# Altium schematic sheet Top_Level.SchDoc
size A4; SheetNumber: 1; SheetTotal: 9
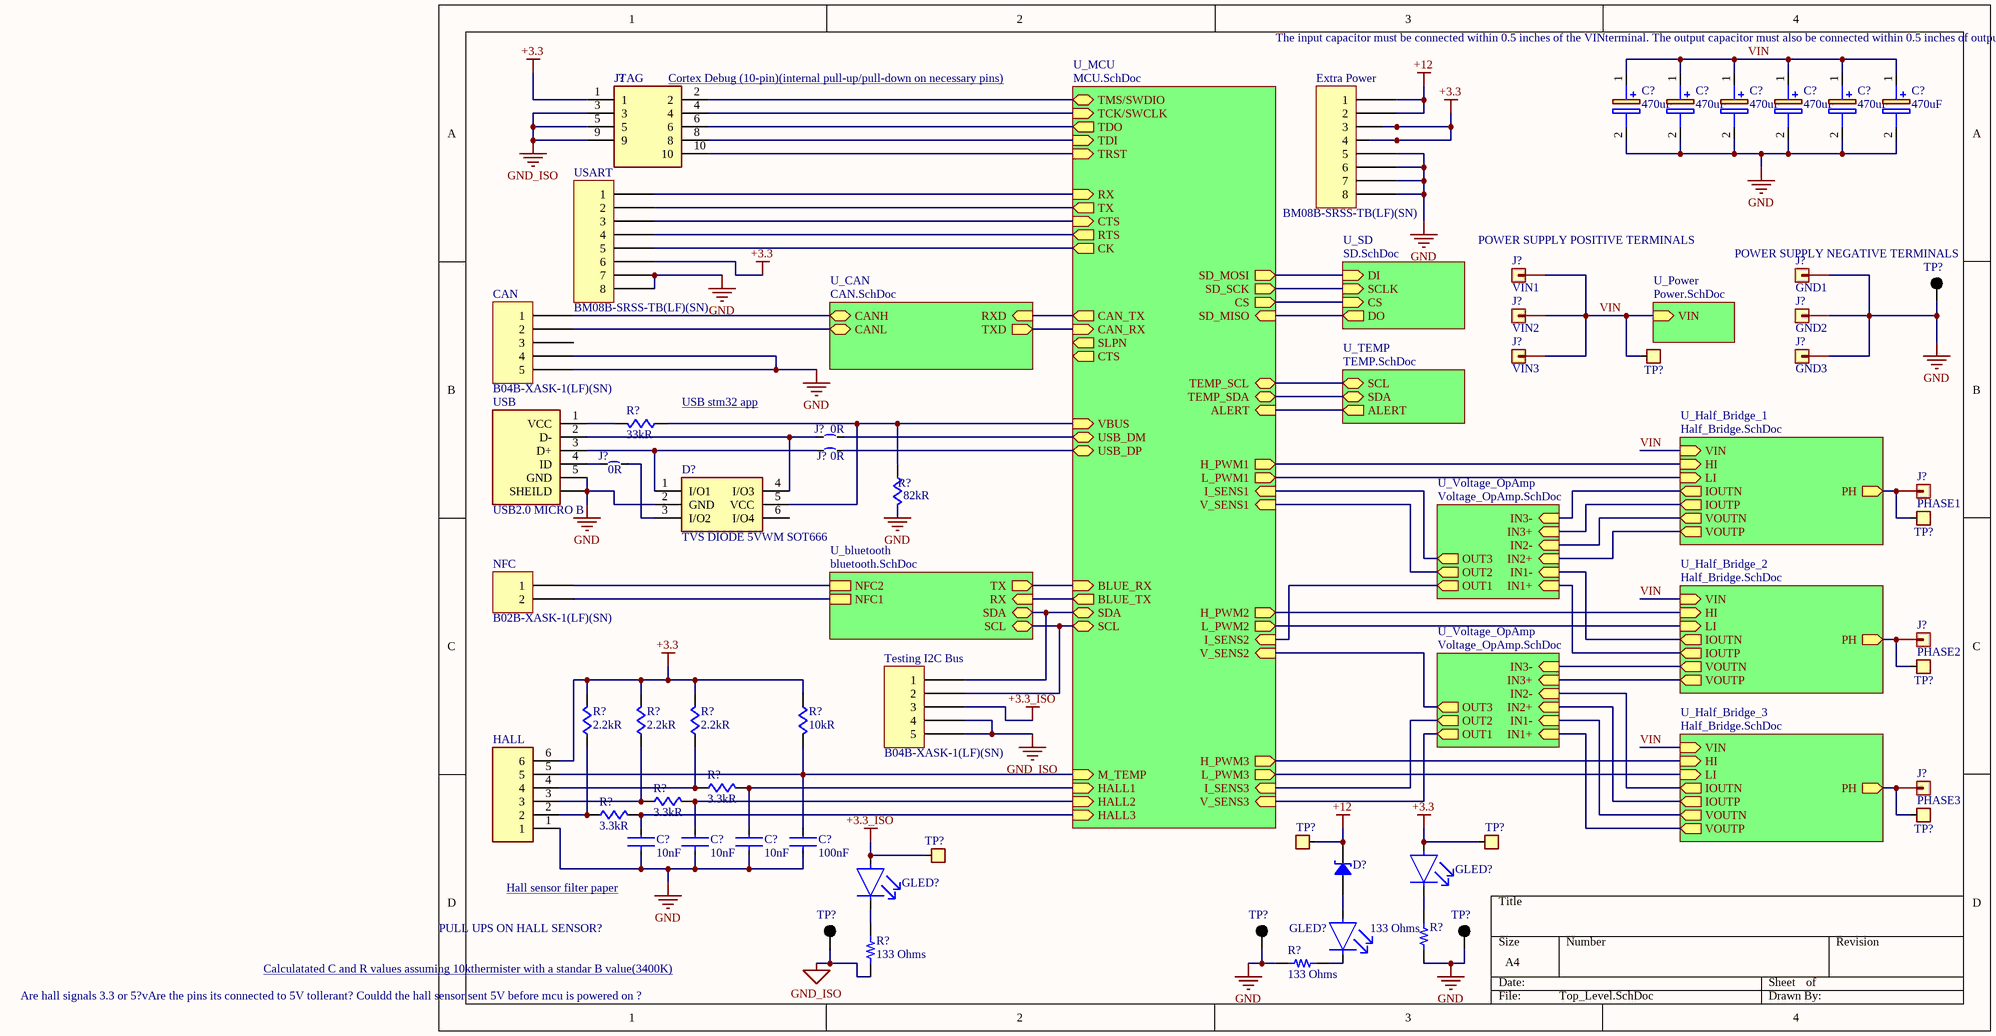
[diagram p0: Top_Level.SchDoc]

## Parts
(Parts that share a designator on the sheet are numbered #1, #2 ... from top to bottom, then left to right.)
C?#1  value 470uF  [EEEFK0J103SM]  (hidden comment: CAP ALUM 470UF 20% 80V SMD)
C?#2  value 470uF  [EEEFK0J103SM]  (hidden comment: CAP ALUM 470UF 20% 80V SMD)
C?#3  value 470uF  [EEEFK0J103SM]  (hidden comment: CAP ALUM 470UF 20% 80V SMD)
C?#4  value 470uF  [EEEFK0J103SM]  (hidden comment: CAP ALUM 470UF 20% 80V SMD)
C?#5  value 470uF  [EEEFK0J103SM]  (hidden comment: CAP ALUM 470UF 20% 80V SMD)
C?#6  value 470uF  [EEEFK0J103SM]  (hidden comment: CAP ALUM 470UF 20% 80V SMD)
C?#7  value 10nF  [FP-CGA3E-0_3-0_1-IPC_C]  (hidden comment: CER 10000PF 100V X7R 0603)
C?#8  value 10nF  [FP-CGA3E-0_3-0_1-IPC_C]  (hidden comment: CER 10000PF 100V X7R 0603)
C?#9  value 10nF  [FP-CGA3E-0_3-0_1-IPC_C]  (hidden comment: CER 10000PF 100V X7R 0603)
C?#10  value 100nF  [FP-CGA3E-0_3-0_1-IPC_C]  (hidden comment: CER 0.1UF 100V X7R 0603)
CAN  B04B-XASK-1(LF)(SN)  [JST B04B-XASK-1]
D?#1  TVS DIODE 5VWM SOT666  [SOTFL50P160X60-6N]
D?#2  MMSZ5238BT1G  [SOD-123]  (value not drawn)
Extra_Power  BM08B-SRSS-TB(LF)(SN)  [JST BM08B-SRSS-TB]
GLED?#1  LED GREEN CLEAR SMD  [FP-LTST-C191KGKT-MFG]  (value not drawn)
GLED?#2  LED GREEN CLEAR SMD  [FP-LTST-C191KGKT-MFG]  (value not drawn)
GLED?#3  LED GREEN CLEAR SMD  [FP-LTST-C191KGKT-MFG]  (value not drawn)
HALL  CONN HEADER VERT 6POS 2MM  [JST B6B-PH-K]  (value not drawn)
J?#1  JTAG  [FTSH10501LDV007K]
J?#2  VIN1  [J100A]
J?#3  GND1  [J100A]
J?#4  VIN2  [J100A]
J?#5  GND2  [J100A]
J?#6  VIN3  [J100A]
J?#7  GND3  [J100A]
J?#8  value 0R  [FP-RK73Z1J-IPC_C]  (hidden comment: RES 0 OHM JUMPER 0603)
J?#9  value 0R  [FP-RK73Z1J-IPC_C]  (hidden comment: RES 0 OHM JUMPER 0603)
J?#10  value 0R  [FP-RK73Z1J-IPC_C]  (hidden comment: RES 0 OHM JUMPER 0603)
J?#11  PHASE1  [J100A]
J?#12  PHASE2  [J100A]
J?#13  PHASE3  [J100A]
NFC  B02B-XASK-1(LF)(SN)  [JST B02B-XASK-1]
R?#1  value 33kR  [FP-RMCF0603-IPC_C]  (hidden comment: x)
R?#2  value 82kR  [FP-RMCF0603-IPC_C]  (hidden comment: x)
R?#3  value 2.2kR  [FP-RMCF0603-IPC_C]  (hidden comment: x)
R?#4  value 2.2kR  [FP-RMCF0603-IPC_C]  (hidden comment: x)
R?#5  value 2.2kR  [FP-RMCF0603-IPC_C]  (hidden comment: x)
R?#6  value 10kR  [FP-RMCF0603-IPC_C]  (hidden comment: RES 10K OHM 1% 1/10W 0603)
R?#7  value 3.3kR  [FP-RMCF0603-IPC_C]  (hidden comment: x)
R?#8  value 3.3kR  [FP-RMCF0603-IPC_C]  (hidden comment: x)
R?#9  value 3.3kR  [FP-RMCF0603-IPC_C]  (hidden comment: x)
R?#10  133 Ohms  [RES 0603_1608]
R?#11  133 Ohms  [RES 0603_1608]
R?#12  133 Ohms  [RES 0603_1608]
Testing_I2C_Bus  B04B-XASK-1(LF)(SN)  [JST B04B-XASK-1]
TP?#1  PC TEST POINT MULTIPURPOSE BLACK  [KSTN-5011_V]  (value not drawn)
TP?#2  PC TEST POINT MINIATURE WHITE  [FP-5002-MFG]  (value not drawn)
TP?#3  PC TEST POINT MINIATURE WHITE  [FP-5002-MFG]  (value not drawn)
TP?#4  PC TEST POINT MINIATURE WHITE  [FP-5002-MFG]  (value not drawn)
TP?#5  PC TEST POINT MINIATURE WHITE  [FP-5002-MFG]  (value not drawn)
TP?#6  PC TEST POINT MINIATURE WHITE  [FP-5002-MFG]  (value not drawn)
TP?#7  PC TEST POINT MINIATURE WHITE  [FP-5002-MFG]  (value not drawn)
TP?#8  PC TEST POINT MINIATURE WHITE  [FP-5002-MFG]  (value not drawn)
TP?#9  PC TEST POINT MULTIPURPOSE BLACK  [KSTN-5011_V]  (value not drawn)
TP?#10  PC TEST POINT MULTIPURPOSE BLACK  [KSTN-5011_V]  (value not drawn)
TP?#11  PC TEST POINT MULTIPURPOSE BLACK  [KSTN-5011_V]  (value not drawn)
USART  BM08B-SRSS-TB(LF)(SN)  [JST BM08B-SRSS-TB]
USB  USB2.0 MICRO B  [101181930001LF]

## Sub-sheets
U_bluetooth = bluetooth.SchDoc: NFC2, NFC1, TX (out), RX (in), SDA (bidir), SCL (bidir)
U_CAN = CAN.SchDoc: CANH (bidir), CANL (bidir), TXD (out), RXD (in)
U_Half_Bridge_1 = Half_Bridge.SchDoc: VIN (in), HI (in), LI (in), PH (out), VOUTP (out), VOUTN (out), IOUTP (out), IOUTN (out)
U_Half_Bridge_2 = Half_Bridge.SchDoc: VIN (in), HI (in), LI (in), PH (out), VOUTN (out), VOUTP (out), IOUTP (out), IOUTN (out)
U_Half_Bridge_3 = Half_Bridge.SchDoc: VIN (in), HI (in), LI (in), PH (out), VOUTP (out), VOUTN (out), IOUTP (out), IOUTN (out)
U_MCU = MCU.SchDoc: I_SENS1 (in), I_SENS2 (in), I_SENS3 (in), V_SENS1 (in), V_SENS3 (in), V_SENS2 (in), L_PWM1 (out), L_PWM2 (out), H_PWM1 (out), H_PWM2 (out), H_PWM3 (out), TX (out), RX (in), HALL1 (in), HALL2 (in), HALL3 (in), M_TEMP (in), TRST (in), TDO (out), TMS/SWDIO (bidir), TCK/SWCLK (in), TDI (in), VBUS (in), USB_DM (bidir), USB_DP (bidir), L_PWM3 (out), TEMP_SCL (bidir), TEMP_SDA (bidir), CAN_RX (in), CAN_TX (out), CTS (out), SLPN (out), ALERT (in), CTS (in), RTS (out), CK (out), SD_SCK (out), SD_MISO (in), SD_MOSI (out), CS (out), BLUE_RX (in), BLUE_TX (out), SDA (bidir), SCL (bidir)
U_Power = Power.SchDoc: VIN (in)
U_SD = SD.SchDoc: DI (in), SCLK (in), DO (out), CS (in)
U_TEMP = TEMP.SchDoc: SCL (bidir), SDA (bidir), ALERT (out)
U_Voltage_OpAmp = Voltage_OpAmp.SchDoc: IN1- (in), IN1+ (in), OUT1 (out), IN2+ (in), IN2- (in), OUT2 (out), IN3+ (in), IN3- (in), OUT3 (out)
U_Voltage_OpAmp = Voltage_OpAmp.SchDoc: IN1- (in), IN1+ (in), OUT1 (out), IN2+ (in), IN2- (in), OUT2 (out), IN3+ (in), IN3- (in), OUT3 (out)

## Nets
+3.3: Extra_Power.3 Extra_Power.4 GLED?#1.2(A) HALL.6 J?#1.1 R?#3.2 R?#4.2 R?#5.2 R?#6.1 TP?#7.1 USART.6
+3.3_ISO: GLED?#2.2(A) Testing_I2C_Bus.3 TP?#8.1
+12: D?#2.2 Extra_Power.1 Extra_Power.2 TP?#6.1
GND: C?#1.2(-) C?#2.2(-) C?#3.2(-) C?#4.2(-) C?#5.2(-) C?#6.2(-) C?#7.1 C?#8.1 C?#9.1 C?#10.1 CAN.4 CAN.5 D?#1.2(GND) Extra_Power.5 Extra_Power.6 Extra_Power.7 Extra_Power.8 HALL.1 J?#3.1(Pin_1) J?#5.1(Pin_1) J?#7.1(Pin_1) R?#2.2 R?#10.1 R?#12.1 TP?#1.1 TP?#10.1 TP?#11.1 USART.7 USART.8 USB.5(GND) USB.MH1(SHEILD) USB.MH2 USB.MP1 USB.MP2 USB.MP3 USB.MP4
GND_ISO: J?#1.3 J?#1.5 J?#1.9 R?#11.1 Testing_I2C_Bus.4 Testing_I2C_Bus.5 TP?#9.1
VIN: C?#1.1(+) C?#2.1(+) C?#3.1(+) C?#4.1(+) C?#5.1(+) C?#6.1(+) J?#2.1(Pin_1) J?#4.1(Pin_1) J?#6.1(Pin_1) TP?#2.1 ; sheet U_Half_Bridge_1/VIN, sheet U_Power/VIN, sheet U_Half_Bridge_2/VIN, sheet U_Half_Bridge_3/VIN
NetC?#7_2: C?#7.2 R?#9.2 ; sheet U_MCU/HALL3
NetC?#8_2: C?#8.2 R?#8.2 ; sheet U_MCU/HALL2
NetC?#9_2: C?#9.2 R?#7.2 ; sheet U_MCU/HALL1
NetC?#10_2: C?#10.2 HALL.5 R?#6.2 ; sheet U_MCU/M_TEMP
NetCAN_1: CAN.1 ; sheet U_CAN/CANH
NetCAN_2: CAN.2 ; sheet U_CAN/CANL
NetD?#1_1: D?#1.1(I/O1) J?#9.1 USB.3(D+)
NetD?#1_3: D?#1.3(I/O2) J?#10.2
NetD?#1_4: D?#1.4(I/O3) J?#8.1 USB.2(D-)
NetD?#1_5: D?#1.5(VCC) R?#1.1 R?#2.1 ; sheet U_MCU/VBUS
NetD?#2_1: D?#2.1 GLED?#3.2(A)
NetGLED?#1_1: GLED?#1.1(C) R?#10.2
NetGLED?#2_1: GLED?#2.1(C) R?#11.2
NetGLED?#3_1: GLED?#3.1(C) R?#12.2
NetHALL_2: HALL.2 R?#3.1 R?#9.1
NetHALL_3: HALL.3 R?#4.1 R?#8.1
NetHALL_4: HALL.4 R?#5.1 R?#7.1
NetJ?#1_2: J?#1.2 ; sheet U_MCU/TMS/SWDIO
NetJ?#1_4: J?#1.4 ; sheet U_MCU/TCK/SWCLK
NetJ?#1_6: J?#1.6 ; sheet U_MCU/TDO
NetJ?#1_8: J?#1.8 ; sheet U_MCU/TDI
NetJ?#1_10: J?#1.10 ; sheet U_MCU/TRST
NetJ?#8_2: J?#8.2 ; sheet U_MCU/USB_DM
NetJ?#9_2: J?#9.2 ; sheet U_MCU/USB_DP
NetJ?#10_1: J?#10.1 USB.4(ID)
NetJ?#11_1: J?#11.1(Pin_1) TP?#3.1 ; sheet U_Half_Bridge_1/PH
NetJ?#12_1: J?#12.1(Pin_1) TP?#4.1 ; sheet U_Half_Bridge_2/PH
NetJ?#13_1: J?#13.1(Pin_1) TP?#5.1 ; sheet U_Half_Bridge_3/PH
NetNFC_1: NFC.1 ; sheet U_bluetooth/NFC2
NetNFC_2: NFC.2 ; sheet U_bluetooth/NFC1
NetR?#1_2: R?#1.2 USB.1(VCC)
NetTesting_I2C_Bus_1: Testing_I2C_Bus.1 ; sheet U_MCU/SDA, sheet U_bluetooth/SDA
NetTesting_I2C_Bus_2: Testing_I2C_Bus.2 ; sheet U_MCU/SCL, sheet U_bluetooth/SCL
NetUSART_1: USART.1 ; sheet U_MCU/RX
NetUSART_2: USART.2 ; sheet U_MCU/TX
NetUSART_3: USART.3 ; sheet U_MCU/CTS
NetUSART_4: USART.4 ; sheet U_MCU/RTS
NetUSART_5: USART.5 ; sheet U_MCU/CK
(unnamed): sheet U_Half_Bridge_1/HI, sheet U_MCU/H_PWM1
(unnamed): sheet U_Half_Bridge_1/LI, sheet U_MCU/L_PWM1
(unnamed): sheet U_Half_Bridge_1/VOUTP, sheet U_Voltage_OpAmp/IN2+
(unnamed): sheet U_Half_Bridge_1/VOUTN, sheet U_Voltage_OpAmp/IN2-
(unnamed): sheet U_Half_Bridge_1/IOUTP, sheet U_Voltage_OpAmp/IN3+
(unnamed): sheet U_Half_Bridge_1/IOUTN, sheet U_Voltage_OpAmp/IN3-
(unnamed): sheet U_MCU/I_SENS1, sheet U_Voltage_OpAmp/OUT3
(unnamed): sheet U_MCU/I_SENS2, sheet U_Voltage_OpAmp/OUT1
(unnamed): sheet U_MCU/I_SENS3, sheet U_Voltage_OpAmp/OUT2
(unnamed): sheet U_MCU/V_SENS1, sheet U_Voltage_OpAmp/OUT2
(unnamed): sheet U_MCU/V_SENS3, sheet U_Voltage_OpAmp/OUT1
(unnamed): sheet U_MCU/V_SENS2, sheet U_Voltage_OpAmp/OUT3
(unnamed): sheet U_MCU/L_PWM2, sheet U_Half_Bridge_2/LI
(unnamed): sheet U_MCU/H_PWM2, sheet U_Half_Bridge_2/HI
(unnamed): sheet U_MCU/H_PWM3, sheet U_Half_Bridge_3/HI
(unnamed): sheet U_MCU/L_PWM3, sheet U_Half_Bridge_3/LI
(unnamed): sheet U_MCU/TEMP_SCL, sheet U_TEMP/SCL
(unnamed): sheet U_MCU/TEMP_SDA, sheet U_TEMP/SDA
(unnamed): sheet U_MCU/CAN_RX, sheet U_CAN/TXD
(unnamed): sheet U_MCU/CAN_TX, sheet U_CAN/RXD
(unnamed): sheet U_MCU/ALERT, sheet U_TEMP/ALERT
(unnamed): sheet U_MCU/SD_SCK, sheet U_SD/SCLK
(unnamed): sheet U_MCU/SD_MISO, sheet U_SD/DO
(unnamed): sheet U_MCU/SD_MOSI, sheet U_SD/DI
(unnamed): sheet U_MCU/CS, sheet U_SD/CS
(unnamed): sheet U_MCU/BLUE_RX, sheet U_bluetooth/TX
(unnamed): sheet U_MCU/BLUE_TX, sheet U_bluetooth/RX
(unnamed): sheet U_Half_Bridge_2/VOUTN, sheet U_Voltage_OpAmp/IN3-
(unnamed): sheet U_Half_Bridge_2/VOUTP, sheet U_Voltage_OpAmp/IN3+
(unnamed): sheet U_Half_Bridge_2/IOUTP, sheet U_Voltage_OpAmp/IN1+
(unnamed): sheet U_Half_Bridge_2/IOUTN, sheet U_Voltage_OpAmp/IN1-
(unnamed): sheet U_Half_Bridge_3/VOUTP, sheet U_Voltage_OpAmp/IN1+
(unnamed): sheet U_Half_Bridge_3/VOUTN, sheet U_Voltage_OpAmp/IN1-
(unnamed): sheet U_Half_Bridge_3/IOUTP, sheet U_Voltage_OpAmp/IN2+
(unnamed): sheet U_Half_Bridge_3/IOUTN, sheet U_Voltage_OpAmp/IN2-

Not connected (* = marked no-connect by the designer): CAN 3; D?#1 6(I/O4)

## Notes on the sheet
- (near C?#1) The input capacitor must be connected within 0.5 inches of the VINterminal. The output capacitor must also be connected within 0.5 inches of output pinText
- (near J?#1) Cortex Debug (10-pin)(internal pull-up/pull-down on necessary pins) <https://developer.arm.com/documentation/101416/0100/Hardware-Description/Target-Interfaces/Cortex-Debug--10-pin->
- (near J?#2) POWER SUPPLY POSITIVE TERMINALS
- (near J?#3) POWER SUPPLY NEGATIVE TERMINALS
- (near R?#1) USB stm32 app <https://www.st.com/resource/en/application_note/an4879-introduction-to-usb-hardware-and-pcb-guidelines-using-stm32-mcus-stmicroelectronics.pdf>
- Hall sensor filter paper <https://ieeexplore.ieee.org/document/7045256?denied=>
- Calculatated C and R values assuming 10kthermister with a standar B value(3400K) <https://www.ti.com/lit/an/sbaa338a/sbaa338a.pdf?ts=1684666864738&ref_url=https%253A%252F%252Fwww.google.com%252F>
- PULL UPS ON HALL SENSOR?
- Are hall signals 3.3 or 5?vAre the pins its connected to 5V tollerant? Couldd the hall sensor sent 5V before mcu is powered on ?

## Library data of the parts
C?#1-C?#6 = EEV-FK1K471M: Manufacturer: Panasonic; Dielectric Material: Aluminium; Polarity: Polarized; Leakage Current: 376uA; Ripple Current: 687.75mA; Tan Delta: 0.08; Reference Standard: AEC-Q200; Supplier: Digi-Key; Supplier Part Number: PCE3496CT-ND; Manufacturer Part Number: EEV-FK1K471M; RoHS: Yes; Category: Aluminum Electrolytic Capacitors; Stock: 7035; Pricing: 1=2.41, 10=1.947, 50=1.6988 (USD); Mounting Technology: Surface Mount; Pins: 2; Case/Package: 7575; Min Operating Temperature: -55°C; Max Operating Temperature: 105°C; Capacitor Type: Aluminium; Tolerance  (fill in as +-): 20%; Package Style: SMTMeter; Packaging: Tape and Reel; Tolerance (fill in as +-): 20%; Rated DC Voltage (URdc): 80V; Termination: Flat; Length: 21mm; Width: 19mm; Height: 16.5mm; Reach SVHC Compliant: Yes; RoHS Compliant: Yes; ComponentLink1URL: https://datasheet.ciiva.com:443/pdfs/VipMasterIC/IC/PANA/PANA-S-A0009782343/PANA-S-A0009782343-1.pdf?src-supplier=IHS+Markit; ComponentLink1Description: https://datasheet.ciiva.com:443/pdfs/VipMasterIC/IC/PANA/PANA-S-A0009782343/PANA-S-A0009782343-1.pdf?src-supplier=IHS+Markit; ComponentLink2URL: https://datasheet.ciiva.com/14606/70258115-14606333.pdf?src-supplier=Allied+Electronics; ComponentLink2Description: https://datasheet.ciiva.com/14606/70258115-14606333.pdf?src-supplier=Allied+Electronics; ComponentLink3URL: https://datasheet.ciiva.com/43485/1676921-43485532.pdf?src-supplier=Farnell; ComponentLink3Description: https://datasheet.ciiva.com/43485/1676921-43485532.pdf?src-supplier=Farnell; ComponentLink4URL: https://datasheet.ciiva.com/2984/aba0000ce120-2984088.pdf?src-supplier=Avnet; ComponentLink4Description: https://datasheet.ciiva.com/2984/aba0000ce120-2984088.pdf?src-supplier=Avnet; ComponentLink5URL: https://datasheet.ciiva.com/30158/eev-fkseries-30158795.pdf?src-supplier=Onlinecomponents.com; ComponentLink5Description: https://datasheet.ciiva.com/30158/eev-fkseries-30158795.pdf?src-supplier=Onlinecomponents.com; ComponentLink6URL: https://datasheet.ciiva.com/14603/70258115-14603897.pdf?src-supplier=Allied+Electronics; ComponentLink6Description: https://datasheet.ciiva.com/14603/70258115-14603897.pdf?src-supplier=Allied+Electronics; ComponentLink7URL: https://datasheet.ciiva.com/48483/aba0000ce120-48483340.pdf?src-supplier=Avnet; ComponentLink7Description: https://datasheet.ciiva.com/48483/aba0000ce120-48483340.pdf?src-supplier=Avnet
C?#7-C?#9 = GCM188R72A103KA37D: Manufacturer: Murata; Dielectric Material: Ceramic; Multilayer: Yes; Tolerance  (fill in as +-): 10%; Reference Standard: AEC-Q200; Supplier: Digi-Key; Supplier Part Number: 490-4781-1-ND; Manufacturer Part Number: GCM188R72A103KA37D; RoHS: Yes; Category: Ceramic Capacitors; Stock: 8991008; Pricing: 1=0.1, 10=0.057, 50=0.031, 100=0.0252, 500=0.01802, 1000=0.01417 (USD); Mounting Technology: Surface Mount; Pins: 2; Package Shape: Rectangular; Case/Package: 0603; Terminal Finish: Nickel; Min Operating Temperature: -55°C; Max Operating Temperature: 125°C; JESD-609 Code: e3; Capacitor Type: Ceramic; Package Style: SMTMeter; Packaging: Tape and Reel; Tolerance (fill in as +-): 10%; Rated DC Voltage (URdc): 100V; Temperature Characteristics Code: X7R; Termination: Wraparound; Length: 1.6mm; Width: 0.8mm; Height: 0.9mm; Reach SVHC Compliant: Yes; RoHS Compliant: Yes; ComponentLink1URL: https://psearch.en.murata.com:443/capacitor/product/GCM188R72A103KA37%23.pdf?src-supplier=IHS+Markit; ComponentLink1Description: https://psearch.en.murata.com:443/capacitor/product/GCM188R72A103KA37%23.pdf?src-supplier=IHS+Markit; ComponentLink2URL: https://datasheet.ciiva.com/132/product-132908.pdf?src-supplier=Digi-Key; ComponentLink2Description: https://datasheet.ciiva.com/132/product-132908.pdf?src-supplier=Digi-Key; ComponentLink3URL: https://datasheet.ciiva.com/132/product-132907.pdf?src-supplier=Digi-Key; ComponentLink3Description: https://datasheet.ciiva.com/132/product-132907.pdf?src-supplier=Digi-Key; ComponentLink4URL: https://datasheet.ciiva.com/132/product-132909.pdf?src-supplier=Digi-Key; ComponentLink4Description: https://datasheet.ciiva.com/132/product-132909.pdf?src-supplier=Digi-Key; ComponentLink5URL: https://datasheet.ciiva.com/16497/product-16497251.pdf?src-supplier=Future+Electronics; ComponentLink5Description: https://datasheet.ciiva.com/16497/product-16497251.pdf?src-supplier=Future+Electronics; ComponentLink6URL: https://datasheet.ciiva.com/18183/getdatasheetpartid-178890-18183651.pdf?src-supplier=Verical; ComponentLink6Description: https://datasheet.ciiva.com/18183/getdatasheetpartid-178890-18183651.pdf?src-supplier=Verical; ComponentLink7URL: https://datasheet.ciiva.com/11786/0900766b80ef92d0-11786108.pdf?src-supplier=Rs; ComponentLink7Description: https://datasheet.ciiva.com/11786/0900766b80ef92d0-11786108.pdf?src-supplier=Rs; ComponentLink8URL: https://datasheet.ciiva.com/11619/product-11619719.pdf?src-supplier=Avnet; ComponentLink8Description: https://datasheet.ciiva.com/11619/product-11619719.pdf?src-supplier=Avnet
C?#10 = GCJ188R72A104KA01D: Manufacturer: Murata; Dielectric Material: Ceramic; Multilayer: Yes; Tolerance  (fill in as +-): 10%; Reference Standard: AEC-Q200; Supplier: Digi-Key; Supplier Part Number: 490-13420-1-ND; Manufacturer Part Number: GCJ188R72A104KA01D; RoHS: Yes; Category: Ceramic Capacitors; Stock: 747319; Pricing: 1=0.2, 10=0.136, 50=0.0814, 100=0.0687, 500=0.047, 1000=0.04158 (USD); Mounting Technology: Surface Mount; Pins: 2; Package Shape: Rectangular; Case/Package: 0603; Terminal Finish: Nickel; Min Operating Temperature: -55°C; Max Operating Temperature: 125°C; JESD-609 Code: e3; Capacitor Type: Ceramic; Package Style: SMTMeter; Packaging: Tape and Reel; Tolerance (fill in as +-): 10%; Rated DC Voltage (URdc): 100V; Temperature Characteristics Code: X7R; Termination: Wraparound; Length: 1.6mm; Width: 0.8mm; Height: 0.8mm; Reach SVHC Compliant: Yes; RoHS Compliant: Yes; ComponentLink1URL: https://datasheet.ciiva.com:443/pdfs/VipMasterIC/IC/MURE/MURE-S-A0004365318/MURE-S-A0004369812-1.pdf?src-supplier=IHS+Markit; ComponentLink1Description: https://datasheet.ciiva.com:443/pdfs/VipMasterIC/IC/MURE/MURE-S-A0004365318/MURE-S-A0004369812-1.pdf?src-supplier=IHS+Markit; ComponentLink2URL: http://search.murata.co.jp/Ceramy/image/img/A01X/partnumbering_e_02.pdf?src-supplier=Digi-Key; ComponentLink2Description: http://search.murata.co.jp/Ceramy/image/img/A01X/partnumbering_e_02.pdf?src-supplier=Digi-Key; ComponentLink3URL: https://www.murata.com/~/media/webrenewal/support/library/catalog/products/capacitor/mlcc/c03e.ashx?la=en-us&src-supplier=Digi-Key; ComponentLink3Description: https://www.murata.com/~/media/webrenewal/support/library/catalog/products/capacitor/mlcc/c03e.ashx?la=en-us&src-supplier=Digi-Key
CAN Testing_I2C_Bus = B04B-XASK-1(LF)(SN): CONN HEADER VERT 4POS 2.5MM; Manufacturer: JST Sales America Inc.; Contact Length - Post: 0.134" (3.40mm); Current Rating (Amps): 3A; Material Flammability Rating: UL94 V-0; Number of Positions: 4; Number of Positions Loaded: All; Pitch - Mating: 0.098" (2.50mm); Row Spacing - Mating: -25°C ~ 85°C; Shrouding: Shrouded - 4 Wall; Style: Board to Cable/Wire; Part Number: B04B-XASK-1(LF)(SN); ComponentLink1Description: Datasheet; ComponentLink1URL: http://www.jst-mfg.com/product/pdf/eng/eXA1.pdf; ComponentLink2Description: DigiKey Link; ComponentLink2URL: https://www.digikey.com/en/products/detail/jst-sales-america-inc/B04B-XASK-1-LF-SN/1634735; Connector Type: Header; Contact Finish - Mating: Tin; Contact Finish - Post: Tin; Contact Material: Copper Alloy; Contact Shape: Circular; Contact Type: Male Pin; Fastening Type: Locking Ramp; Insulation Color: Natural; Insulation Height: 0.346" (8.80mm); Insulation Material: Polyamide (PA66), Nylon 6/6, Glass Filled; LastUpdated: 2022-11-24 6:27:57 AM; Lifecycle Status: Active; Minimum Order: 1; Mounting Type: Through Hole; Number of Rows: 1; Operating Temperature: -25°C ~ 85°C; Packaging: Bulk; PartId: 176; Part Status: Active; Price: 0.11; Series: XA; Supplier 1: DigiKey; Supplier Part Number 1: 455-1994-ND; Termination: Press-Fit, Solder
D?#1 = DSILC6-4P6: Manufacturer: STMicroelectronics; Direction: Unidirectional; Value: 2.5pF; Operating Supply Voltage: 5V; Max Surge Current: 7A; Reverse Breakdown Voltage: 6V; Number of Elements: 1; Number of Channels: 4; Peak Pulse Power: 120W; Power Line Protection: Yes; Leakage Current: 500nA; Test Current: 1mA; Peak Pulse Current: 5A; Max Power Dissipation: 90W; Supplier: Digi-Key; Supplier Part Number: 497-5544-1-ND; Manufacturer Part Number: DSILC6-4P6; RoHS: Yes; Category: TVS Diodes; Stock: 53924; Pricing: 1=0.95, 10=0.849, 100=0.6621, 500=0.54698, 1000=0.43183 (USD); Mounting Technology: Surface Mount; Case/Package: SOT-666; Pins: 6; Min Operating Temperature: -55°C; Max Operating Temperature: 125°C; Package Quantity: 3000; Packaging: Tape and Reel; Reverse Standoff Voltage: 5V; Min Breakdown Voltage: 6V; Polarity: Unidirectional; Breakdown Voltage: 6V; Termination: SMD/SMT; ESD Protection: Yes; Max Reverse Leakage Current: 500nA; Max Breakdown Voltage: 6V; Voltage Rating (DC): 6V; Power Rating: 120W; Series: DSI; Number of Unidirectional Channels: 4; Length: 1.7mm; Width: 1.3mm; Height: 0.6mm; Depth: 1.3mm; Radiation Hardening: No; Reach SVHC Compliant: No; Lead Free: Lead Free; RoHS Compliant: Yes; ComponentLink1URL: https://datasheet.ciiva.com/4511/cd00130230-99038-4511753.pdf?src-supplier=Mouser; ComponentLink1Description: https://datasheet.ciiva.com/4511/cd00130230-99038-4511753.pdf?src-supplier=Mouser; ComponentLink2URL: https://datasheet.ciiva.com/15143/getdatasheetpartid-65137-15143194.pdf?src-supplier=Verical; ComponentLink2Description: https://datasheet.ciiva.com/15143/getdatasheetpartid-65137-15143194.pdf?src-supplier=Verical; ComponentLink3URL: https://datasheet.ciiva.com/338/cd00130230-338497.pdf?src-supplier=Digi-Key; ComponentLink3Description: https://datasheet.ciiva.com/338/cd00130230-338497.pdf?src-supplier=Digi-Key; ComponentLink4URL: https://datasheet.ciiva.com/338/cd00130230-338496.pdf?src-supplier=Digi-Key; ComponentLink4Description: https://datasheet.ciiva.com/338/cd00130230-338496.pdf?src-supplier=Digi-Key; ComponentLink5URL: https://datasheet.ciiva.com/338/cd00130230-338498.pdf?src-supplier=Digi-Key; ComponentLink5Description: https://datasheet.ciiva.com/338/cd00130230-338498.pdf?src-supplier=Digi-Key; ComponentLink6URL: https://datasheet.ciiva.com/16495/cd00130230-16495053.pdf?src-supplier=Future+Electronics; ComponentLink6Description: https://datasheet.ciiva.com/16495/cd00130230-16495053.pdf?src-supplier=Future+Electronics
D?#2 = MMSZ5238BT1G: DIODE ZENER 8.7V 500MW SOD123; Manufacturer: ON Semiconductor; Current - Reverse Leakage @ Vr: 3µA @ 6.5V; Impedance (Max) (Zzt): 8 Ohms; Tolerance: ±5%; Voltage - Forward (Vf) (Max) @ If: 900mV @ 10mA; Part Number: MMSZ5238BT1G; ComponentLink1Description: Datasheet; ComponentLink1URL: http://www.onsemi.com/pub/Collateral/MMSZ5221BT1-D.PDF; ComponentLink2Description: DigiKey Link; ComponentLink2URL: http://digikey.com/product-detail/en/on-semiconductor/MMSZ5238BT1G/MMSZ5238BT1GOSCT-ND/2705143; LastUpdated: 2023-06-28 8:14:45 PM; Lifecycle Status: Active; Minimum Order: 1; Mounting Type: Surface Mount; Operating Temperature: -55°C ~ 150°C; Package / Case: SOD-123; Packaging: TapeAndReel; PartId: 2312; Part Status: Active; Power - Max: 500mW; Price: 0.04; Series: -; Supplier 1: DigiKey; Supplier Part Number 1: MMSZ5238BT1GOSCT-ND; Supplier Device Package: SOD-123; Voltage - Zener (Nom) (Vz): 8.7V
Extra_Power USART = BM08B-SRSS-TB(LF)(SN): CONN HEADER SMD 8POS 1MM; Manufacturer: JST Sales America Inc.; Current Rating (Amps): 0.7A; Material Flammability Rating: UL94 V-0; Number of Positions: 8; Number of Positions Loaded: All; Pitch - Mating: 0.039" (1.00mm); Shrouding: Shrouded - 4 Wall; Style: Board to Cable/Wire; Voltage Rating: 50V; Part Number: BM08B-SRSS-TB(LF)(SN); ComponentLink1Description: Datasheet; ComponentLink1URL: http://www.jst-mfg.com/product/pdf/eng/eSR.pdf; ComponentLink2Description: DigiKey Link; ComponentLink2URL: http://digikey.com/product-detail/en/jst-sales-america-inc/BM08B-SRSS-TB-LF-SN/455-1794-1-ND/926865; Connector Type: Header; Contact Finish - Mating: Tin; Contact Finish - Post: Tin; Contact Material: Copper Alloy; Contact Shape: Square; Contact Type: Male Pin; Fastening Type: Push-Pull; Features: Solder Retention; Insulation Color: Natural; Insulation Height: 0.167" (4.25mm); Insulation Material: Polyamide (PA), Nylon; LastUpdated: 2020-01-12 10:15:38 PM; Lifecycle Status: Active; Minimum Order: 1; Mounting Type: Surface Mount; Number of Rows: 1; Operating Temperature: -25°C ~ 85°C; Packaging: TapeAndReel; PartId: 24; Part Status: Active; Price: 0.44; Series: SR; Supplier 1: DigiKey; Supplier Part Number 1: 455-1794-1-ND; Termination: Solder
GLED?#1-GLED?#3 = LTST-C191KGKT: Manufacturer: Vishay Lite-On; Shape: Rectangular; Lens Style: WATER CLEAR; Forward Current: 30mA; Luminous Intensity-Nom: 35mcd; Channels: 1; Optoelectronic Device Type: SINGLE COLOR LED; Viewing Angle: 130°; Forward Voltage: 2.4V; Reverse Voltage-Max: 5V; Overall Height: 0.55mm; Supplier: Digi-Key; Supplier Part Number: 160-1446-1-ND; Manufacturer Part Number: LTST-C191KGKT; RoHS: Yes; Category: Uncategorized; Stock: 1696489; Pricing: 1=0.26, 10=0.141, 100=0.0656, 500=0.0606, 1000=0.04747, 2000=0.04646 (USD); Mounting Technology: Surface Mount; Pins: 2; Color: Green; Color@wavelength: Green; Terminal Finish: Tin; Min Operating Temperature: -55°C; Max Operating Temperature: 85°C; Packaging: Tape and Reel; JESD-609 Code: e3; Size: 1.1mm; Terminal Pitch: 1.5mm; Reach SVHC Compliant: Yes; RoHS Compliant: Yes; ComponentLink1URL: https://datasheet.ciiva.com:443/pdfs/VipMasterIC/IC/LITE/LITE-S-A0003156116/LITE-S-A0003156116-1.pdf?src-supplier=IHS+Markit; ComponentLink1Description: https://datasheet.ciiva.com:443/pdfs/VipMasterIC/IC/LITE/LITE-S-A0003156116/LITE-S-A0003156116-1.pdf?src-supplier=IHS+Markit; ComponentLink2URL: https://datasheet.ciiva.com/2109/ltst-c191kgkt-2109973.pdf?src-supplier=Digi-Key; ComponentLink2Description: https://datasheet.ciiva.com/2109/ltst-c191kgkt-2109973.pdf?src-supplier=Digi-Key
HALL = B6B-PH-K-S(LF)(SN): Manufacturer: JST; Contact Resistance: 20mR; Current Rating: 2A; Voltage Rating: 100V; Number of Positions: 6; Insulation Resistance: 1MR; Gender: Male; Mated Stacking Heights: 8mm; Supplier: Digi-Key; Supplier Part Number: 455-1708-ND; Manufacturer Part Number: B6B-PH-K-S(LF)(SN); RoHS: Yes; Category: Headers and Wire Housings; Stock: 93503; Pricing: 1=0.36, 10=0.304, 100=0.2362, 500=0.20242, 1000=0.16868, 5000=0.14458, 10000=0.13495 (USD); Mounting Technology: Through Hole; Pins: 6; Contact Material: Brass,Tin; Contact Plating: Tin,Copper; Housing Color: White; Housing Material: Polyamide; Contact Shape: Square; Contact Finish - Mating: TIN; Insulation Material: Nylon; Insulation Color: Natural; Min Operating Temperature: -25°C; Max Operating Temperature: 85°C; Number of Rows: 1; Packaging: Bulk; Max Current Rating: 2A; Termination: Solder; Fastening Type: Detent; Number of Contacts: 6; Max Voltage Rating (AC): 100V; Orientation: Straight; Series: PH; Contact Type: Male Pin; Number of Poles: 6; Voltage Rating (AC): 100V; Working Voltage: 100V; Connector Type: Header; Length: 13.9mm; Width: 4.5mm; Height: 9.4mm; Pitch: 2mm; Lead Pitch: 2mm; Depth: 4.5mm; Reach SVHC Compliant: No; Lead Free: Lead Free; Flammability Rating: UL94 V-0; ComponentLink1URL: https://datasheet.ciiva.com/712/eph-712563.pdf?src-supplier=Digi-Key; ComponentLink1Description: https://datasheet.ciiva.com/712/eph-712563.pdf?src-supplier=Digi-Key; ComponentLink2URL: https://datasheet.ciiva.com/26894/getdatasheetpartid-639917-26894487.pdf?src-supplier=Verical; ComponentLink2Description: https://datasheet.ciiva.com/26894/getdatasheetpartid-639917-26894487.pdf?src-supplier=Verical; ComponentLink3URL: https://datasheet.ciiva.com/8052/80560-8052027.pdf?src-supplier=Element14; ComponentLink3Description: https://datasheet.ciiva.com/8052/80560-8052027.pdf?src-supplier=Element14
J?#1 = FTSH-105-01-L-DV-007-K: CONN HEADER SMD 10POS 1.27MM
J?#2-J?#7 J?#11-J?#13 = J100A: Connector pad, 110 A
J?#8-J?#10 = RK73Z1JTTD: Manufacturer: KOA Speer; Rated Temperature: 70°C; Package Height: 0.45mm; Package Length: 1.6mm; Package Width: 0.8mm; Reference Standard: AEC-Q200; Supplier: Digi-Key; Supplier Part Number: 2019-RK73Z1JTTDCT-ND; Manufacturer Part Number: RK73Z1JTTD; RoHS: Yes; Category: Chip SMD Resistors; Stock: 8562065; Pricing: 1=0.1, 10=0.016, 50=0.0088, 100=0.0065, 500=0.00396, 1000=0.00292 (USD); Mounting Technology: Surface Mount; Pins: 2; Case/Package: 0603; Terminal Finish: Nickel; Min Operating Temperature: -55°C; Max Operating Temperature: 155°C; JESD-609 Code: e3; Resistor Type: FIXED RESISTOR; Construction: Rectangular; Package Style: SMTMeter; Packaging: Tape and Reel; Termination: Wraparound; Reach SVHC Compliant: Yes; RoHS Compliant: Yes; ComponentLink1URL: https://datasheet.ciiva.com:443/pdfs/VipMasterIC/IC/KOAS/KOAS-S-A0009586251/KOAS-S-A0009586308-1.pdf?src-supplier=IHS+Markit; ComponentLink1Description: https://datasheet.ciiva.com:443/pdfs/VipMasterIC/IC/KOAS/KOAS-S-A0009586251/KOAS-S-A0009586308-1.pdf?src-supplier=IHS+Markit; ComponentLink2URL: https://datasheet.ciiva.com/7816/549012-7816884.pdf?src-supplier=Element14; ComponentLink2Description: https://datasheet.ciiva.com/7816/549012-7816884.pdf?src-supplier=Element14; ComponentLink3URL: https://datasheet.ciiva.com/26914/getdatasheetpartid-123499-26914653.pdf?src-supplier=Verical; ComponentLink3Description: https://datasheet.ciiva.com/26914/getdatasheetpartid-123499-26914653.pdf?src-supplier=Verical
NFC = B02B-XASK-1(LF)(SN): CONN HEADER VERT 2POS 2.5MM; Manufacturer: JST Sales America Inc.; Contact Length - Post: 0.134" (3.40mm); Current Rating (Amps): 3A; Material Flammability Rating: UL94 V-0; Number of Positions: 2; Number of Positions Loaded: All; Pitch - Mating: 0.098" (2.50mm); Row Spacing - Mating: -25°C ~ 85°C; Shrouding: Shrouded - 4 Wall; Style: Board to Cable/Wire; Part Number: B02B-XASK-1(LF)(SN); ComponentLink1Description: Datasheet; ComponentLink1URL: http://www.jst-mfg.com/product/pdf/eng/eXA1.pdf; ComponentLink2Description: DigiKey Link; ComponentLink2URL: https://www.digikey.com/en/products/detail/jst-sales-america-inc/B02B-XASK-1-LF-SN/1634730; Connector Type: Header; Contact Finish - Mating: Tin; Contact Finish - Post: Tin; Contact Material: Copper Alloy; Contact Shape: Circular; Contact Type: Male Pin; Fastening Type: Locking Ramp; Insulation Color: Natural; Insulation Height: 0.346" (8.80mm); Insulation Material: Polyamide (PA66), Nylon 6/6, Glass Filled; LastUpdated: 2022-11-24 6:26:44 AM; Lifecycle Status: Active; Minimum Order: 1; Mounting Type: Through Hole; Number of Rows: 1; Operating Temperature: -25°C ~ 85°C; Packaging: Bulk; PartId: 174; Part Status: Active; Price: 0.07; Series: XA; Supplier 1: DigiKey; Supplier Part Number 1: 455-1989-ND; Termination: Press-Fit, Solder
R?#1-R?#5 R?#7-R?#9 = RES 0603
R?#6 = RMCF0603FT10K0: Manufacturer: Stackpole Electronics; Power: 100mW; Rated Temperature: 70°C; Temperature Coefficient: 100ppm/°C; Working Voltage: 75V; Package Height: 0.45mm; Package Length: 1.55mm; Package Width: 0.8mm; Reference Standard: AEC-Q200; Supplier: Digi-Key; Supplier Part Number: RMCF0603FT10K0CT-ND; Manufacturer Part Number: RMCF0603FT10K0; RoHS: Yes; Category: Chip SMD Resistors; Stock: 10390822; Pricing: 1=0.1, 10=0.015, 50=0.009, 100=0.0075, 500=0.00498, 1000=0.00425 (USD); Mounting Technology: Surface Mount; Pins: 2; Package Shape: Rectangular; Case/Package: 0603; Terminal Finish: Nickel; Min Operating Temperature: -55°C; Max Operating Temperature: 155°C; Tolerance: 1%; JESD-609 Code: e3; Resistor Type: FIXED RESISTOR; Construction: Rectangular; Package Style: SMTMeter; Packaging: Tape and Reel; Technology: METAL GLAZE/THICK FILM; Termination: Wraparound; Reach SVHC Compliant: Yes; RoHS Compliant: Yes; ComponentLink1URL: https://datasheet.ciiva.com:443/pdfs/VipMasterIC/IC/SEIE/SEIE-S-A0009541969/SEIE-S-A0009541969-1.pdf?src-supplier=IHS+Markit; ComponentLink1Description: https://datasheet.ciiva.com:443/pdfs/VipMasterIC/IC/SEIE/SEIE-S-A0009541969/SEIE-S-A0009541969-1.pdf?src-supplier=IHS+Markit; ComponentLink2URL: http://components.arrow.com/part/dataview/43747082S6756917N1174?src-supplier=Arrow+Electronics; ComponentLink2Description: http://components.arrow.com/part/dataview/43747082S6756917N1174?src-supplier=Arrow+Electronics; ComponentLink3URL: https://www.seielect.com/catalog/SEI-RMCF_RMCP.pdf?src-supplier=Avnet; ComponentLink3Description: https://www.seielect.com/catalog/SEI-RMCF_RMCP.pdf?src-supplier=Avnet; ComponentLink4URL: http://www.seielect.com/catalog/sei-rmc.pdf?src-supplier=Future+Electronics; ComponentLink4Description: http://www.seielect.com/catalog/sei-rmc.pdf?src-supplier=Future+Electronics; ComponentLink5URL: https://www.verical.com/server-webapp/html/getDatasheet?partID=360913&src-supplier=Verical; ComponentLink5Description: https://www.verical.com/server-webapp/html/getDatasheet?partID=360913&src-supplier=Verical; ComponentLink6URL: https://www.seielect.com/catalog/sei-rmcf_rmcp.pdf?src-supplier=Digi-Key; ComponentLink6Description: https://www.seielect.com/catalog/sei-rmcf_rmcp.pdf?src-supplier=Digi-Key
R?#10-R?#12 = ERJ-3EKF1330V: RES SMD 133 OHM 1% 1/10W 0603; Manufacturer: Panasonic Electronic Components; Power (Watts): 0.1W, 1/10W; Temperature Coefficient: ±100ppm/°C; Part Number: ERJ-3EKF1330V; Value: 133 Ohms; ComponentLink1Description: Datasheet; ComponentLink1URL: https://industrial.panasonic.com/cdbs/www-data/pdf/RDA0000/AOA0000C304.pdf; ComponentLink2Description: DigiKey Link; ComponentLink2URL: https://www.digikey.com/en/products/detail/panasonic-electronic-components/ERJ-3EKF1330V/196117; Composition: Thick Film; Device Package: 0603 (1608 Metric); Features: Automotive AEC-Q200; Height - Seated (Max): 0.022" (0.55mm); LastUpdated: 2023-06-27 7:34:06 PM; Lifecycle Status: Active; Minimum Order: 1; Number of Terminations: 2; Operating Temperature: -55°C ~ 155°C; Package / Case: 0603 (1608 Metric); Packaging: TapeAndReel; PartId: 26027; Part Status: Active; Price: 0.01; Ratings: AEC-Q200; Resistance: 133 Ohms; Series: ERJ-3EK; Size / Dimension: 0.063" L x 0.031" W (1.60mm x 0.80mm); Supplier 1: DigiKey; Supplier Part Number 1: P133HCT-ND; Supplier Device Package: 0603; Tolerance: ±1%
TP?#1 TP?#9-TP?#11 = 5011: Manufacturer: Keystone Electronics; Connector Type: Interconnection Device; Supplier: Digi-Key; Supplier Part Number: 36-5011-ND; Manufacturer Part Number: 5011; RoHS: Yes; Category: Connectors; Stock: 642738; Pricing: 1=0.38, 25=0.308, 100=0.3015, 250=0.28304, 500=0.2523, 1000=0.17746, 2500=0.16225, 5000=0.15211 (USD); Reach SVHC Compliant: Yes; RoHS Compliant: Yes; ComponentLink1URL: https://datasheet.ciiva.com:443/pdfs/VipMasterIC/IC/KEYC/KEYC-S-A0000709140/KEYC-S-A0000709140-1.pdf?src-supplier=IHS+Markit; ComponentLink1Description: https://datasheet.ciiva.com:443/pdfs/VipMasterIC/IC/KEYC/KEYC-S-A0000709140/KEYC-S-A0000709140-1.pdf?src-supplier=IHS+Markit; ComponentLink2URL: https://datasheet.ciiva.com/1454/1718230-1454834.pdf?src-supplier=Element14; ComponentLink2Description: https://datasheet.ciiva.com/1454/1718230-1454834.pdf?src-supplier=Element14; ComponentLink3URL: https://datasheet.ciiva.com/11744/0900766b8009b7c7-11744935.pdf?src-supplier=Rs; ComponentLink3Description: https://datasheet.ciiva.com/11744/0900766b8009b7c7-11744935.pdf?src-supplier=Rs; ComponentLink4URL: https://datasheet.ciiva.com/2917/5011-2917635.pdf?src-supplier=Digi-Key; ComponentLink4Description: https://datasheet.ciiva.com/2917/5011-2917635.pdf?src-supplier=Digi-Key; ComponentLink5URL: https://datasheet.ciiva.com/16351/m60-2p60-16351093.pdf?src-supplier=Future+Electronics; ComponentLink5Description: https://datasheet.ciiva.com/16351/m60-2p60-16351093.pdf?src-supplier=Future+Electronics; ComponentLink6URL: https://datasheet.ciiva.com/46412/1703983-46412138.pdf?src-supplier=Element14; ComponentLink6Description: https://datasheet.ciiva.com/46412/1703983-46412138.pdf?src-supplier=Element14
TP?#2-TP?#8 = 5002: Manufacturer: Keystone Electronics; Connector Type: Interconnection Device; Supplier: Digi-Key; Supplier Part Number: 36-5002-ND; Manufacturer Part Number: 5002; RoHS: Yes; Category: Connectors; Stock: 1311223; Pricing: 1=0.38, 25=0.308, 100=0.3015, 250=0.28304, 500=0.2523, 1000=0.17746, 2500=0.16225, 5000=0.15211 (USD); Contact Finish - Termination: Silver (Ag); JESD-609 Code: e4; Reach SVHC Compliant: Yes; RoHS Compliant: Yes; ComponentLink1URL: https://datasheet.ciiva.com:443/pdfs/VipMasterIC/IC/KEYC/KEYCS01036/KEYCS02044-1.pdf?src-supplier=IHS+Markit; ComponentLink1Description: https://datasheet.ciiva.com:443/pdfs/VipMasterIC/IC/KEYC/KEYCS01036/KEYCS02044-1.pdf?src-supplier=IHS+Markit; ComponentLink2URL: https://datasheet.ciiva.com/22631/1703983-22631101.pdf?src-supplier=Element14; ComponentLink2Description: https://datasheet.ciiva.com/22631/1703983-22631101.pdf?src-supplier=Element14; ComponentLink3URL: https://datasheet.ciiva.com/16351/m60-2p60-16351079.pdf?src-supplier=Future+Electronics; ComponentLink3Description: https://datasheet.ciiva.com/16351/m60-2p60-16351079.pdf?src-supplier=Future+Electronics; ComponentLink4URL: https://datasheet.ciiva.com/2917/5000-5004-2917628.pdf?src-supplier=Digi-Key; ComponentLink4Description: https://datasheet.ciiva.com/2917/5000-5004-2917628.pdf?src-supplier=Digi-Key
USB = 10118193-0001LF: FCI Right Angle Surface Mount Mount Female USB Connector; 100 V ac; 1.8A; Manufacturer: Amphenol ICC / FCI; Supplier: Digi-Key; Supplier Part Number: 609-4616-1-ND; Manufacturer Part Number: 10118193-0001LF; RoHS: No; Category: USB Connectors; Stock: 298826; Pricing: 1=0.46, 10=0.404, 25=0.3696, 50=0.3478, 100=0.3334, 250=0.30436, 500=0.28988 (USD); ComponentLink1URL: http://uk.rs-online.com/webdocs/1450/0900766b814507f1.pdf?src-supplier=Rs; ComponentLink1Description: http://uk.rs-online.com/webdocs/1450/0900766b814507f1.pdf?src-supplier=Rs; ComponentLink2URL: https://cdn.amphenol-icc.com/media/wysiwyg/files/documentation/datasheet/inputoutput/io_usb_micro.pdf?src-supplier=Verical; ComponentLink2Description: https://cdn.amphenol-icc.com/media/wysiwyg/files/documentation/datasheet/inputoutput/io_usb_micro.pdf?src-supplier=Verical; ComponentLink3URL: https://cdn.amphenol-icc.com/media/wysiwyg/files/documentation/datasheet/inputoutput/io_usb_micro.pdf?src-supplier=Avnet; ComponentLink3Description: https://cdn.amphenol-icc.com/media/wysiwyg/files/documentation/datasheet/inputoutput/io_usb_micro.pdf?src-supplier=Avnet; ComponentLink4URL: http://www.amphenol-icc.com/media/wysiwyg/files/drawing/10118193.pdf?src-supplier=Digi-Key; ComponentLink4Description: http://www.amphenol-icc.com/media/wysiwyg/files/drawing/10118193.pdf?src-supplier=Digi-Key; ComponentLink5URL: https://cdn.amphenol-icc.com/media/wysiwyg/files/documentation/datasheet/inputoutput/io_usb_micro.pdf?src-supplier=Digi-Key; ComponentLink5Description: https://cdn.amphenol-icc.com/media/wysiwyg/files/documentation/datasheet/inputoutput/io_usb_micro.pdf?src-supplier=Digi-Key; ComponentLink6URL: https://cdn.amphenol-icc.com/media/wysiwyg/files/documentation/datasheet/inputoutput/io_usb_micro.pdf?src-supplier=Arrow+Electronics; ComponentLink6Description: https://cdn.amphenol-icc.com/media/wysiwyg/files/documentation/datasheet/inputoutput/io_usb_micro.pdf?src-supplier=Arrow+Electronics; ComponentLink7URL: https://cdn.amphenol-icc.com/media/wysiwyg/files/documentation/datasheet/inputoutput/io_usb_micro.pdf?src-supplier=Allied+Electronics; ComponentLink7Description: https://cdn.amphenol-icc.com/media/wysiwyg/files/documentation/datasheet/inputoutput/io_usb_micro.pdf?src-supplier=Allied+Electronics; ComponentLink8URL: https://cdn.amphenol-icc.com/media/wysiwyg/files/documentation/datasheet/inputoutput/io_usb_micro.pdf?src-supplier=Onlinecomponents.com; ComponentLink8Description: https://cdn.amphenol-icc.com/media/wysiwyg/files/documentation/datasheet/inputoutput/io_usb_micro.pdf?src-supplier=Onlinecomponents.com; ComponentLink9URL: https://cdn.amphenol-icc.com/media/wysiwyg/files/documentation/datasheet/inputoutput/io_usb_micro.pdf?src-supplier=Mouser; ComponentLink9Description: https://cdn.amphenol-icc.com/media/wysiwyg/files/documentation/datasheet/inputoutput/io_usb_micro.pdf?src-supplier=Mouser; ComponentLink10URL: https://cdn.amphenol-icc.com/media/wysiwyg/files/documentation/datasheet/inputoutput/io_usb_micro.pdf?src-supplier=Rs; ComponentLink10Description: https://cdn.amphenol-icc.com/media/wysiwyg/files/documentation/datasheet/inputoutput/io_usb_micro.pdf?src-supplier=Rs; ComponentLink11URL: https://cdn.amphenol-icc.com/media/wysiwyg/files/documentation/datasheet/inputoutput/io_usb_micro.pdf?src-supplier=Heilind+Electronics; ComponentLink11Description: https://cdn.amphenol-icc.com/media/wysiwyg/files/documentation/datasheet/inputoutput/io_usb_micro.pdf?src-supplier=Heilind+Electronics; ComponentLink12URL: https://cdn.amphenol-icc.com/media/wysiwyg/files/documentation/datasheet/inputoutput/io_usb_micro.pdf?src-supplier=TTI; ComponentLink12Description: https://cdn.amphenol-icc.com/media/wysiwyg/files/documentation/datasheet/inputoutput/io_usb_micro.pdf?src-supplier=TTI; ComponentLink13URL: https://cdn.amphenol-icc.com/media/wysiwyg/files/documentation/datasheet/inputoutput/io_usb_micro.pdf?src-supplier=TME; ComponentLink13Description: https://cdn.amphenol-icc.com/media/wysiwyg/files/documentation/datasheet/inputoutput/io_usb_micro.pdf?src-supplier=TME